# EAGLE design esp8266-pcb (EAGLE 6.4)
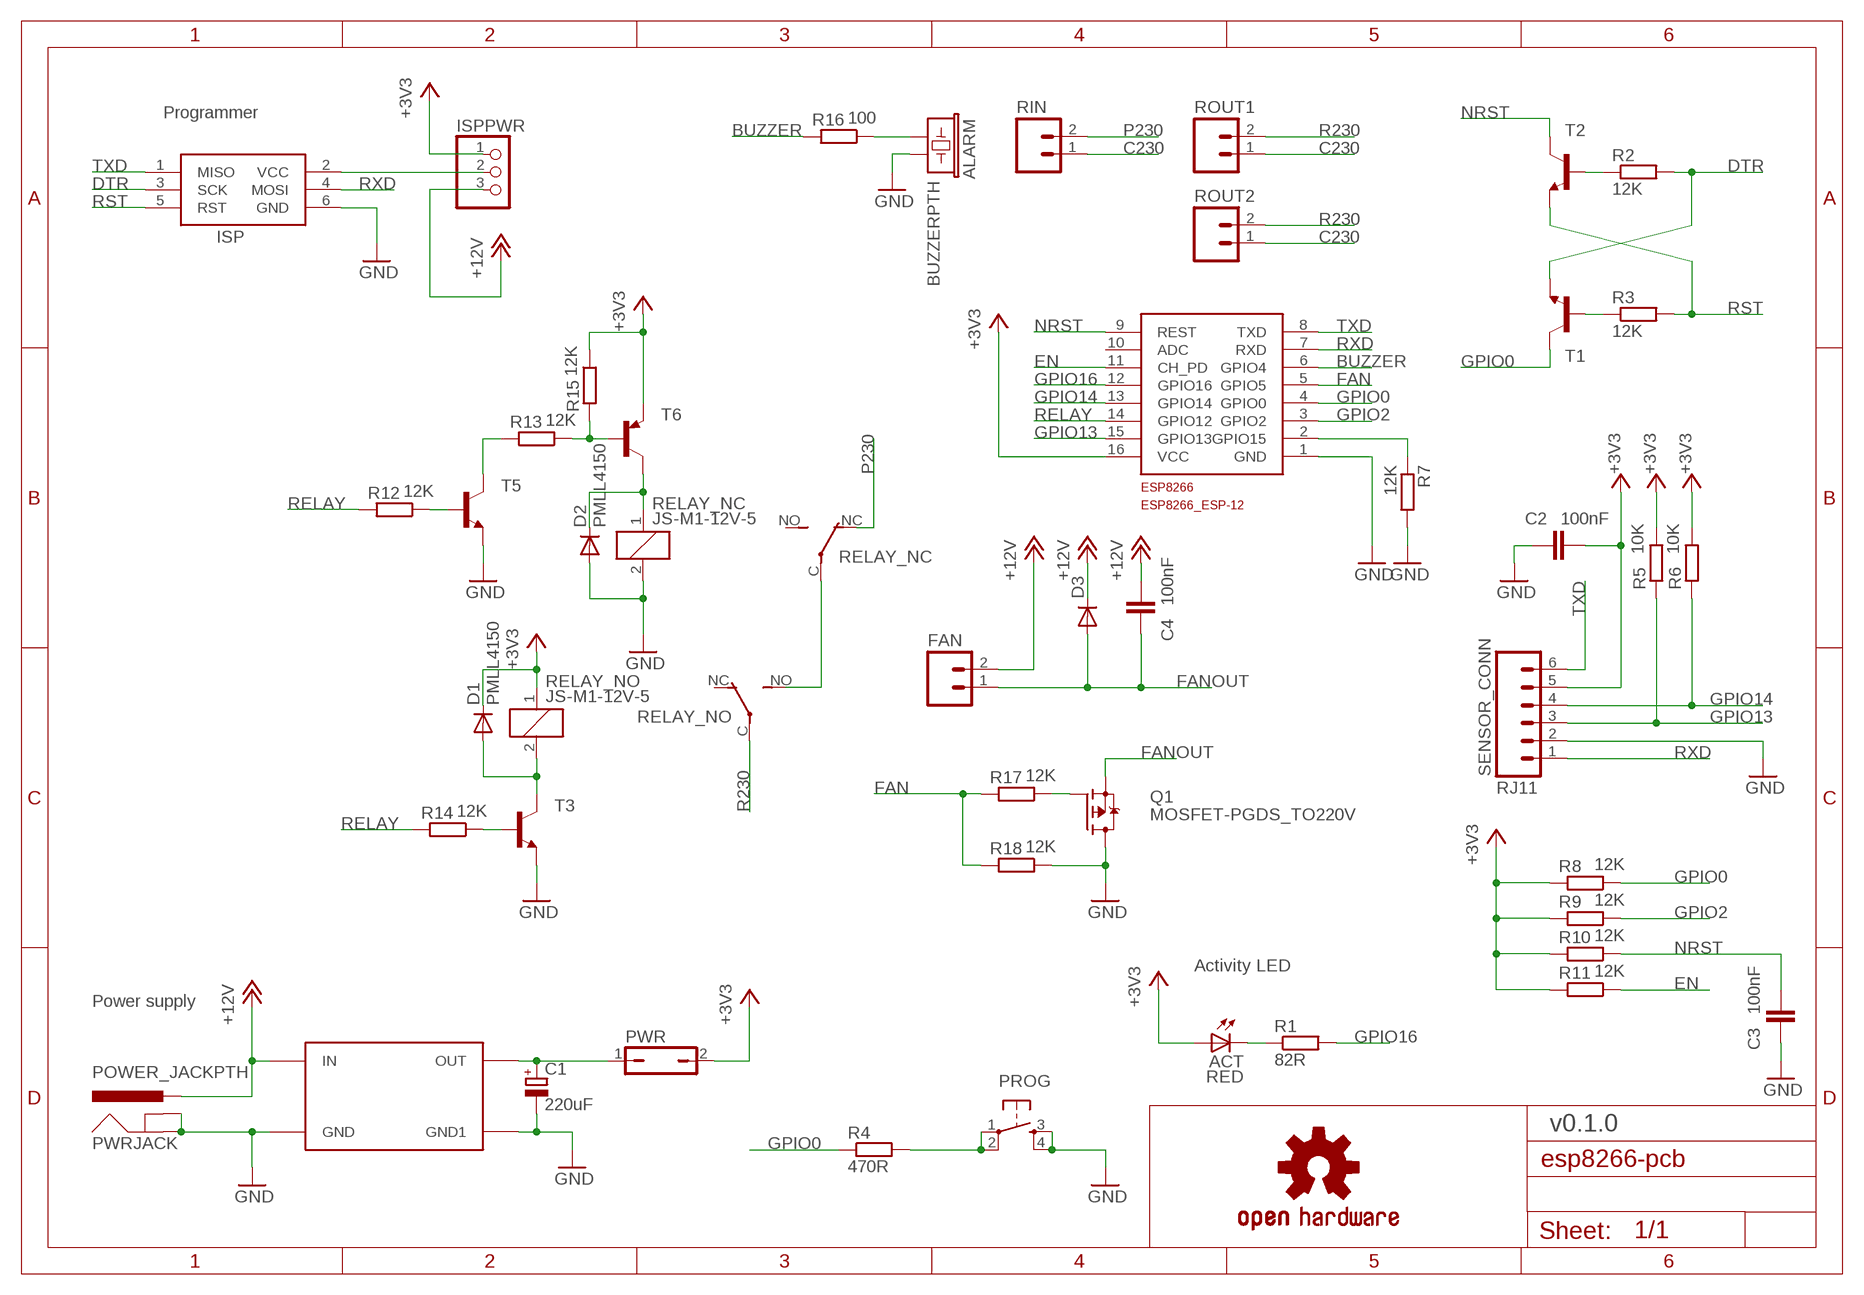
[diagram p0: schematic, sheet 1]

## Parts
ACT  RED  LEDSMT1206  [1206]
ALARM  BUZZERPTH  [BUZZER-12MM]
C1  220uF  CPOL-EUE2.5-6  [E2,5-6]
C2  100nF  C-EUC0805  [C0805]
C3  100nF  C-EUC0805  [C0805]
C4  100nF  C-EUC0805  [C0805]
D1  PMLL4150  [SOD80C]
D2  PMLL4150  [SOD80C]
D3  DIODE-MELF-MLL41  [MELF-MLL41]
ESP8266  ESP8266_ESP-12  [ESP8266-ESP12]
FAN  M025MM  [SCREWTERMINAL-5MM-2]
ISP  AVRISP-6  [AVRISP]
ISPPWR  PINHD-1X3  [1X03]
PROG  TAC_SWITCHPTH  [TACTILE-PTH]
PWR  JP1Q  [JP1]
PWRJACK  POWER_JACKPTH  [POWER_JACK_PTH]
Q1  MOSFET-PGDS_TO220V  [TO220V]
R1  82R  R-EU_R0805  [R0805]
R2  12K  R-EU_R0805  [R0805]
R3  12K  R-EU_R0805  [R0805]
R4  470R  R-EU_R0805  [R0805]
R5  10K  R-EU_R0805  [R0805]
R6  10K  R-EU_R0805  [R0805]
R7  12K  R-EU_R0805  [R0805]
R8  12K  R-EU_R0805  [R0805]
R9  12K  R-EU_R0805  [R0805]
R10  12K  R-EU_R0805  [R0805]
R11  12K  R-EU_R0805  [R0805]
R12  12K  R-EU_R0805  [R0805]
R13  12K  R-EU_R0805  [R0805]
R14  12K  R-EU_R0805  [R0805]
R15  12K  R-EU_R0805  [R0805]
R16  100  R-EU_R0805  [R0805]
R17  12K  R-EU_R0805  [R0805]
R18  12K  R-EU_R0805  [R0805]
RELAY_NC  JS-M1-12V-5  [JS-M]
RELAY_NO  JS-M1-12V-5  [JS-M]
RIN  M025MM  [SCREWTERMINAL-5MM-2]
ROUT1  M025MM  [SCREWTERMINAL-5MM-2]
ROUT2  M025MM  [SCREWTERMINAL-5MM-2]
SENSOR_CONN  RJ11  RJ11-6PTH  [RJ11-6]
T1  BC808-NPN-SOT23-BEC  [SOT23-BEC]
T2  BC808-NPN-SOT23-BEC  [SOT23-BEC]
T3  BC808-NPN-SOT23-BEC  [SOT23-BEC]
T5  BC808-NPN-SOT23-BEC  [SOT23-BEC]
T6  BC807-16-PNP-SOT23-BEC  [SOT23-BEC]
U$1  OSHW-LOGOL  [OSHW-LOGO-L]
U$2  DC-DC-SMALL  [DC-DC]

## Nets
+3V3: ACT.A C2.2 D1.C ESP8266.16(VCC) ISPPWR.1 PWR.2 R5.2 R6.2 R8.2 R9.2 R10.2 R11.2 R15.1 RELAY_NO.1 SENSOR_CONN.5 T6.E
+12V: C4.2 D3.C FAN.2 ISPPWR.3 PWRJACK.PWR U$2.P$1(IN)
BUZZER: ESP8266.6(GPIO4) R16.2
C230: RIN.1 ROUT1.1 ROUT2.1
DTR: ISP.3(SCK) R2.2 T1.E
EN: ESP8266.11(CH_PD) R11.1
FAN: ESP8266.5(GPIO5) R17.2 R18.2
FANOUT: C4.1 D3.A FAN.1 Q1.3(S)
GND: ALARM.- C1.- C2.1 C3.1 D2.A ESP8266.1(GND) ISP.6(GND) PROG.3 PROG.4 PWRJACK.GND PWRJACK.GNDBREAK Q1.2(D) R7.2 R18.1 RELAY_NC.2 SENSOR_CONN.2 T3.E T5.E U$2.P$3(GND) U$2.P$4(GND1)
GPIO0: ESP8266.4(GPIO0) R4.1 R8.1 T1.C
GPIO2: ESP8266.3(GPIO2) R9.1
GPIO13: ESP8266.15(GPIO13) R5.1 SENSOR_CONN.3
GPIO14: ESP8266.13(GPIO14) R6.1 SENSOR_CONN.4
GPIO16: ESP8266.12(GPIO16) R1.2
N$1: ACT.C R1.1
N$2: C1.+ PWR.1 U$2.P$2(OUT)
N$3: R2.1 T2.B
N$4: PROG.1 PROG.2 R4.2
N$5: ESP8266.2(GPIO15) R7.1
N$6: ISP.2(VCC) ISPPWR.2
N$7: R3.1 T1.B
N$8: ALARM.+ R16.1
N$9: D1.A RELAY_NO.2 T3.C
N$11: R14.1 T3.B
N$12: R12.1 T5.B
N$13: R13.2 T5.C
N$14: R13.1 R15.2 T6.B
N$15: D2.C RELAY_NC.1 T6.C
N$17: RELAY_NC.C(2:P) RELAY_NO.NO(2:S)
N$18: Q1.1(G) R17.1
NRST: C3.2 ESP8266.9(REST) R10.1 T2.C
P230: RELAY_NC.NC(2:O) RIN.2
R230: RELAY_NO.C(2:P) ROUT1.2 ROUT2.2
RELAY: ESP8266.14(GPIO12) R12.2 R14.2
RST: ISP.5(RST) R3.2 T2.E
RXD: ESP8266.7(RXD) ISP.4(MOSI) SENSOR_CONN.1
TXD: ESP8266.8(TXD) ISP.1(MISO) SENSOR_CONN.6
Unconnected: ESP8266.10(ADC) RELAY_NC.NO(2:S) RELAY_NO.NC(2:O)

## Notes on the sheet
- Programmer
- Activity LED
- Power supply
- v0.1.0

## Library data of the parts
ACT = led:LED: LED OSRAM: - CHIPLED LG R971, LG N971, LY N971, LG Q971, LY Q971, LO R971, LY R971 LH N974, LH R974 LS Q976, LO Q976, LY Q976 LO Q996 - Hyper CHIPLED LW Q18S LB Q993, LB Q99A, LB R99A - SideLED LS A670, LO A670, LY A670, LG A670, LP A670 LB A673, LV A673, LT A673, LW A673 LH A674 LY A675 LS A676, LA A676, LO A676, LY A676, LW A676 LS A679, LY A679, LG A679 - Hyper Micro SIDELED® LS Y876, LA Y876, LO Y876, LY Y876 LT Y87S - SmartLED LW L88C, LW L88S LB L89C, LB L89S, LG L890 LS L89K, LO L89K, LY L89K LS L896, LA L896, LO L896, LY L896 - TOPLED LS T670, LO T670, LY T670, LG T670, LP T670 LSG T670, LSP T670, LSY T670, LOP T670, LYG T670 LG T671, LOG T671, LSG T671 LB T673, LV T673, LT T673, LW T673 LH T674 LS T676, LA T676, LO T676, LY T676, LB T676, LH T676, LSB T676, LW T676 LB T67C, LV T67C, LT T67C, LS T67K, LO T67K, LY T67K, LW E67C LS E67B, LA E67B, LO E67B, LY E67B, LB E67C, LV E67C, LT E67C LW T67C LS T679, LY T679, LG T679 LS T770, LO T770, LY T770, LG T770, LP T770 LB T773, LV T773, LT T773, LW T773 LH T774 LS E675, LA E675, LY E675, LS T675 LS T776, LA T776, LO T776, LY T776, LB T776 LHGB T686 LT T68C, LB T68C - Hyper Mini TOPLED® LB M676 - Mini TOPLED Santana® LG M470 LS M47K, LO M47K, LY M47K Source: http://www.osram.convergy.de LUXEON: - LUMILED® LXK2-PW12-R00, LXK2-PW12-S00, LXK2-PW14-U00, LXK2-PW14-V00 LXK2-PM12-R00, LXK2-PM12-S00, LXK2-PM14-U00 LXK2-PE12-Q00, LXK2-PE12-R00, LXK2-PE12-S00, LXK2-PE14-T00, LXK2-PE14-U00 LXK2-PB12-K00, LXK2-PB12-L00, LXK2-PB12-M00, LXK2-PB14-N00, LXK2-PB14-P00, LXK2-PB14-Q00 LXK2-PR12-L00, LXK2-PR12-M00, LXK2-PR14-Q00, LXK2-PR14-R00 LXK2-PD12-Q00, LXK2-PD12-R00, LXK2-PD12-S00 LXK2-PH12-R00, LXK2-PH12-S00 LXK2-PL12-P00, LXK2-PL12-Q00, LXK2-PL12-R00 Source: www.luxeon.com KINGBRIGHT: KA-3528ASYC Source: www.kingbright.com
ALARM = SparkFun:BUZZER: Buzzer 12mm Spark Fun Electronics SKU : Comp-Buzzer
C1 = rcl:CPOL-EU: POLARIZED CAPACITOR, European symbol
C2-C4 = rcl:C-EU: CAPACITOR, European symbol
D1 D2 = diode:PMLL4150: DIODE high speed
D3 = diode:DIODE-: DIODE
ESP8266 = ESP8266-ESP12:ESP8266_ESP-12
FAN RIN ROUT1 ROUT2 = SparkFun-Connectors:M02: Standard 2-pin 0.1" header. Use with - straight break away headers ( PRT-00116) - right angle break away headers (PRT-00553) - swiss pins (PRT-00743) - machine pins (PRT-00117) - female headers (PRT-00115) Molex polarized connector foot print use with: PRT-08233 with associated crimp pins and housings. 2.54_SCREWTERM for use with PRT-10571. 3.5mm Screw Terminal footprints for PRT-08084 5mm Screw Terminal footprints for use with PRT-08432; STOREFRONT_ID: PRT-08432
ISP = adafruit:AVRISP: AVR ISP HEADER Standard 6 pin header for AVR programming
ISPPWR = pinhead:PINHD-1X3: PIN HEADER
PROG = SparkFun-Retired:TAC_SWITCH: Momentary Switch Button commonly used for reset or general input. Spark Fun Electronics SKU : COM-00097 SMT- SWCH-08247
PWR = jumper:JP1Q: JUMPER
PWRJACK = SparkFun-Connectors:POWER_JACK: Power Jack This is the standard 5.5mm barrel jack for power. The PTH is the most common, proven, reliable, footprint. The Slot footprint only works if the mill layer is transmitted to the PCB fab house so be warned. Mating wall wart : TOL-00298 (and others); PROD_ID: CONN-08197
Q1 = adafruit:MOSFET-P
R1-R18 = rcl:R-EU_: RESISTOR, European symbol
RELAY_NC RELAY_NO = relay:JS-M1*: Automotive Ultra-Miniature Power Relay NAiS Source: http://www.mew-europe.com/.. en_ds_61211_0000.pdf
SENSOR_CONN = SparkFun-Connectors:RJ11-6: RJ11 Jack Simple 6 pin RJ11 jack. Commonly found on CAT3 devices and Microchip programmers. SKU: PRT-00132; PROD_ID: CONN-08590
T1-T3 T5 = transistor:*-NPN-: NPN Transistror BF959 corrected 2008.03.06
T6 = transistor:*-PNP-: PNP Transistror
U$1 = SparkFun:OSHW-LOGO: Open Source Hardware Logo This logo indicates the piece of hardware it is found on incorporates a OSHW license and/or adheres to the definition of open source hardware found here: http://freedomdefined.org/OSHW
U$2 = OK1CDJ-E6:DC-DC-SMALL

## Board
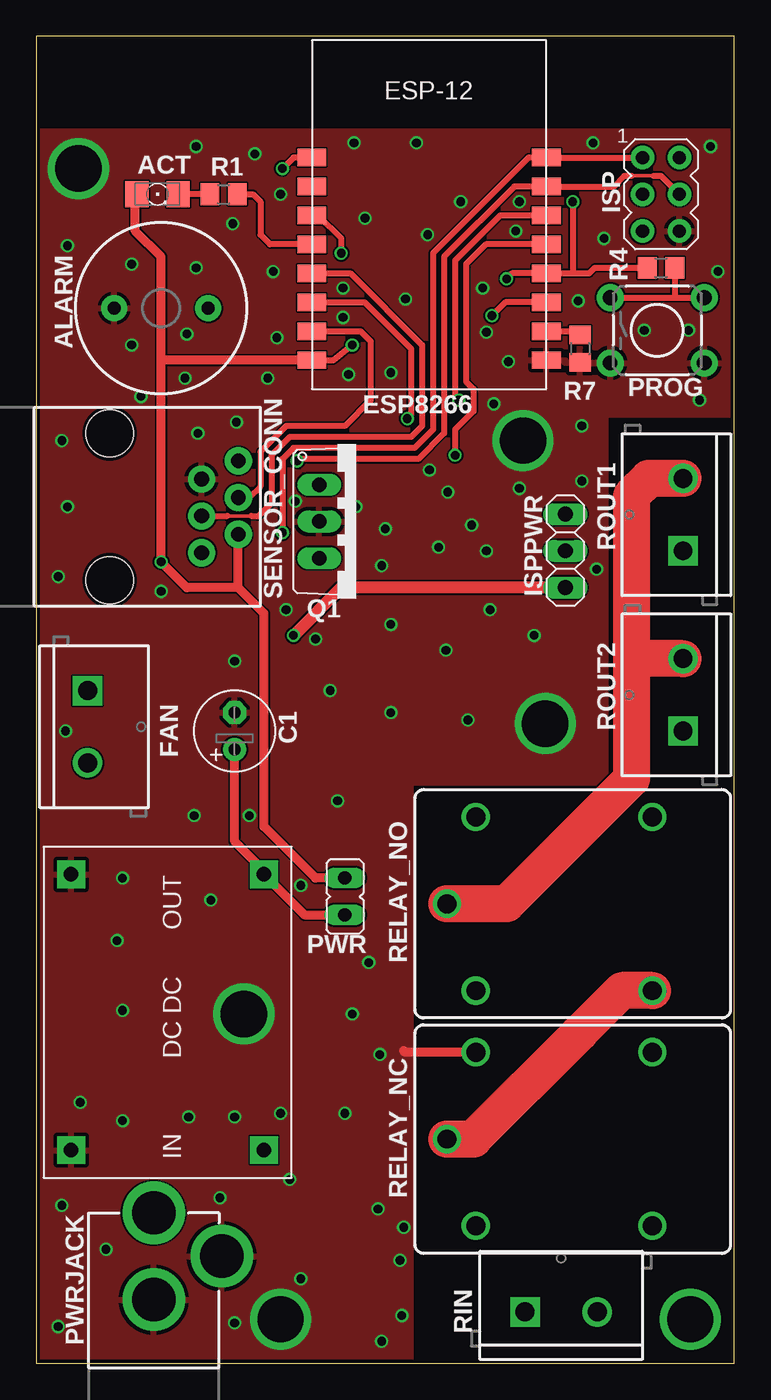
[diagram p1: board, top side]
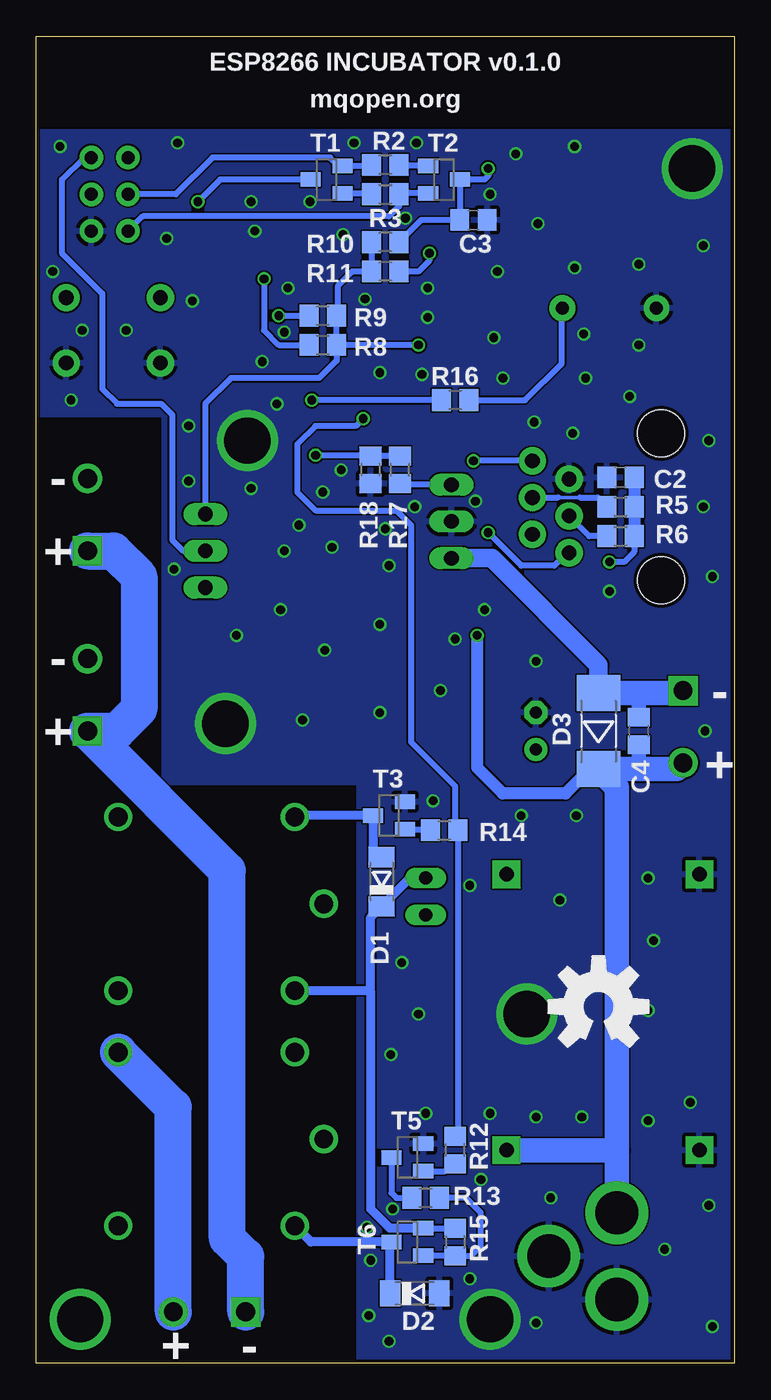
[diagram p2: board, bottom side, seen from below]

Size 48.26 x 91.69 mm. Coordinates in mm from the lower left corner, seen from the top.
Outline: 0,0 48.26,0 48.26,91.69 0,91.69 0,0
Copper layers (1*16): Top 0.035mm / dielectric 1.5mm / Bottom 0.035mm
Design rules "dirt_cheap_dirty_boards.v1": minimum track width 5mil, minimum drill 12mil, track to track 5mil, track to pad 5mil, pad to pad 5mil, via to via 5mil, smd to smd 0mil, copper to edge 10mil, drill to drill 10mil, minimum pad ring 10mil, minimum via ring 6mil, stop-mask expansion 2mil, vias tented up to drill 25mil, thermal gap 10mil

### Footprints (pad centres in the part's own frame; a part is rotated, then mirrored left to right if it is on the bottom)
1206 = smd 1.6 x 1.803: A -1.422,0; C 1.422,0
BUZZER-12MM = drill 0.9 pad 1.778: + 3.25,0; - -3.25,0
E2,5-6 = drill 0.813 pad 1.6: + -1.27,0 | drill 0.813 pad 1.6 octagon: - 1.27,0
C0805 = smd 1.3 x 1.5: 1 -0.95,0; 2 0.95,0
SOD80C = smd 1.4 x 1.8: A 1.7,0; C -1.7,0
MELF-MLL41 = smd 2.5 x 3: A 2.625,0; C -2.625,0
ESP8266-ESP12 = smd 2 x 1.2: 1 16.2,2; 2 16.2,4; 3 16.2,6; 4 16.2,8; 5 16.2,10; 6 16.2,12; 7 16.2,14; 8 16.2,16; 9 0,16; 10 0,14; 11 0,12; 12 0,10; 13 0,8; 14 0,6; 15 0,4; 16 0,2
SCREWTERMINAL-5MM-2 = drill 1.3 pad 2.032 square: 1 0,0 | drill 1.3 pad 2.032: 2 5,0
AVRISP = drill 0.9 pad 1.626: 1 -1.27,2.54; 2 1.27,2.54; 3 -1.27,0; 4 1.27,0; 5 -1.27,-2.54; 6 1.27,-2.54
1X03 = drill 1.016 long: 1 -2.54,0; 2 0,0; 3 2.54,0
TACTILE-PTH = drill 1.016 pad 1.88: 1 -3.251,2.261; 2 3.251,2.261; 3 -3.251,-2.261; 4 3.251,-2.261
JP1 = drill 0.914 long: 1 0,-1.27; 2 0,1.27
POWER_JACK_PTH = drill 2.997 pad 4.318: GND 0,7.7; GNDBREAK 4.7,10.7; PWR 0,13.7
TO220V = drill 1.016 long: 1 -2.54,-2.54; 2 0,-2.54; 3 2.54,-2.54
R0805 = smd 1.3 x 1.5: 1 -0.95,0; 2 0.95,0
JS-M = drill 1.3: 1 6.7,6; 2 6.7,-6; C 8.7,0; NC -5.5,-6; NO -5.5,6
RJ11-6 = drill 1.016 pad 1.88: 1 -3.175,8.89; 2 -1.905,6.35; 3 -0.635,8.89; 4 0.635,6.35; 5 1.905,8.89; 6 3.175,6.35 | hole 3.251: -5.08,0; 5.08,0
SOT23-BEC = smd 1 x 1.4: B -0.95,-1.1; C 0,1.1; E 0.95,-1.1
DC-DC = drill 1 pad 1.93 square: P$1 1.27,1.27; P$2 20.32,1.27; P$3 1.27,14.605; P$4 20.32,14.605

### Placement (x,y rotation side)
ACT  8.38,80.77 0 top
ALARM  8.64,72.9 0 top
C1  13.72,43.69 90 top
C2  7.87,61.21 0 bottom
C3  18.03,78.99 180 bottom
C4  6.6,43.69 270 bottom
D1  24.38,33.27 90 bottom
D2  22.1,4.83 0 bottom
D3  9.4,43.69 90 bottom
ESP8266  19.05,67.31 0 top
FAN  3.56,46.48 270 top
ISP  43.18,80.77 0 top
ISPPWR  36.58,56.13 270 top
PROG  42.93,71.37 0 top
PWR  21.34,32.26 0 top
PWRJACK  8.13,-3.3 0 top
Q1  22.1,58.17 270 top
R1  12.95,80.77 0 top
R2  24.13,82.8 180 bottom
R3  24.13,80.77 0 bottom
R4  43.18,75.69 0 top
R5  7.87,59.18 0 bottom
R6  7.87,57.15 0 bottom
R7  37.59,70.1 270 top
R8  28.45,70.36 0 bottom
R9  28.45,72.39 0 bottom
R10  24.13,77.47 180 bottom
R11  24.13,75.44 180 bottom
R12  19.3,14.73 90 bottom
R13  21.34,11.43 180 bottom
R14  20.07,36.83 0 bottom
R15  19.3,8.38 270 bottom
R16  19.3,66.55 180 bottom
R17  23.11,61.72 90 bottom
R18  25.15,61.72 90 bottom
RELAY_NC  37.08,15.49 180 top
RELAY_NO  37.08,31.75 180 top
RIN  33.78,3.56 0 top
ROUT1  44.7,56.13 90 top
ROUT2  44.7,43.69 90 top
SENSOR_CONN  5.08,59.18 270 top
T1  28.19,81.79 90 bottom
T2  20.07,81.79 270 bottom
T3  23.88,37.85 90 bottom
T5  22.61,14.22 90 bottom
T6  22.61,8.38 90 bottom
U$1  9.4,24.64 0 bottom
U$2  17.02,13.46 90 top

### Tracks (layer width: path | path; a pad name or v marks a point on that pad's centre or on a via)
+3V3  (via drill 0.6)
  Top 0.406: ESP8266.16 20.54,69.31 v21.84,70.36
  Top 0.61: PWR.2 19.3,33.53 15.75,37.08 15.75,51.82 13.97,53.59 | 13.97,53.59 10.41,53.59 v8.64,55.37 8.64,69.34 | 13.97,53.59 SENSOR_CONN.5 | 8.64,69.34 8.64,76.45 6.86,78.23 6.86,80.67 ACT.A | ESP8266.16 8.67,69.31 8.64,69.34
  Bottom 0.406: T6.E R15.1 | R6.2 6.92,56.07 7.62,55.37 v8.64,55.37 | v21.84,70.36 R8.2 | R8.2 R9.2 27.43,72.46 27.43,74.42 26.42,75.44 R11.2 R10.2 | R8.2 27.5,69.28 28.7,68.07 34.8,68.07 36.58,66.29 ISPPWR.1
  Bottom 0.61: T6.E 23.81,9.33 25.15,10.67 25.15,25.65 | 25.15,25.65 25.15,30.81 D1.C 22.43,33.53 PWR.2 | RELAY_NO.1 25.24,25.75 25.15,25.65
  Bottom 0.813: C2.2 R5.2 R6.2
+12V  (via drill 0.6)
  Top 0.813: ISPPWR.3 21.08,53.59 v17.78,50.29
  Bottom 0.813: D3.C 9.99,41.06 11.68,39.37 16,39.37 17.78,41.15 v17.78,50.29
  Bottom 1.016: C4.2 6.6,41.06
  Bottom 1.676: PWRJACK.PWR 8.13,14.73 | 8.13,14.73 8.13,39.79 D3.C 6.6,41.06 3.98,41.06 FAN.2 | U$2.P$1 8.13,14.73
BUZZER  (via drill 0.6)
  Top 0.406: v29.21,66.55 28.96,66.8 28.96,76.2 32.07,79.31 ESP8266.6
  Bottom 0.406: R16.2 v29.21,66.55
C230
  Bottom 2.54: RIN.1 33.78,7.37 35.05,8.64 35.05,34.04 ROUT2.1 42.67,43.69 41.15,45.21 41.15,54.36 42.93,56.13 ROUT1.1
DTR
  Bottom 0.406: R2.2 25.15,82.74 T1.E 27.37,82.74 27.94,83.31 36.07,83.31 38.61,80.77 ISP.3
EN  (via drill 0.6)
  Top 0.406: ESP8266.11 19.5,79.31 21.08,77.72 v21.08,76.71
  Bottom 0.406: v21.08,76.71 21.08,76.2 21.84,75.44 R11.1
FAN  (via drill 0.6)
  Top 0.406: v28.96,62.74 28.96,64.52 30.23,65.79 30.23,67.31 29.72,67.82 29.72,75.95 31.08,77.31 ESP8266.5
  Bottom 0.406: R17.2 R18.2 25.21,62.74 v28.96,62.74
FANOUT
  Bottom 1.016: C4.1 6.6,46.31
  Bottom 1.27: Q1.3 16.76,55.63 9.4,48.26 D3.A
  Bottom 1.676: D3.A 6.6,46.31 3.73,46.31 FAN.1
GND  (via drill 0.6, 3.2)
  Top 0.61: RELAY_NC.2 25.5,21.49 25.4,21.59
  other vias: 21.84,24.13 20.83,38.86 13.72,17.02 5.59,29.21 3.05,18.03 12.7,11.43 23.62,10.67 25.15,7.11 25.4,9.4 18.29,5.84 17.53,12.7 21.34,17.27 13.72,2.79 4.83,7.87 1.78,10.92 1.52,2.54 23.88,1.52 18.29,33.02 19.3,50.04 10.92,37.85 2.03,43.69 1.52,54.36 1.78,63.75 11.18,64.26 8.64,53.34 17.27,52.07 27.18,61.72 28.45,60.2 24.13,57.66 23.88,55.12 21.59,68.33 16,68.07 10.41,71.12 6.6,70.36 6.6,75.95 21.21,74.3 21.21,72.26 24.51,68.45 25.53,73.53 32.64,69.22 31.11,71.25 30.86,74.3 33.15,78.23 33.4,80.26 29.34,80.26 27.05,77.98 21.97,84.33 26.29,84.33 16.89,80.77 15.11,83.57 2.92,82.55 2.16,77.22 11.05,84.07 11.05,75.69 13.59,78.74 39.24,77.72 46.61,84.07 38.48,84.33 47.12,75.44 45.09,71.37 42.04,71.37 37.47,73.41 37.72,64.77 45.85,66.55 31.62,66.29 30.1,57.91 31.11,56.13 33.4,60.45 37.72,60.96 38.73,54.86 34.42,50.29 31.37,52.07 24.51,51.05 24.51,44.96 28.32,49.28 22.99,27.69 12.06,32 16.89,17.27 10.54,17.02 5.97,24.38 5.97,16.76 5.97,33.53 23.75,21.34 25.27,3.3 27.81,56.39 13.84,65.02 10.29,68.07 7.24,66.8 2.16,59.18 16.38,75.44 16.64,70.87 22.73,79.12 16.89,3.05 33.66,63.75 14.35,24.13 22.1,59.18 17.91,59.56 29.84,44.45 14.73,37.85 13.72,48.51 20.32,46.48 35.18,44.2
  pour Bottom: -0.25,85.09 -0.25,-0.25 25.91,-0.25 25.91,40.13 39.37,40.13 39.37,65.53 48.51,65.53 48.51,85.09
  pour Top: -0.25,85.09 -0.25,-0.25 25.91,-0.25 25.91,40.13 39.37,40.13 39.37,65.53 48.51,65.53 48.51,85.09
GPIO0  (via drill 0.6)
  Top 0.406: 37.08,75.31 ESP8266.4 32.89,75.31 v32.51,74.93 | 37.08,75.31 38.23,75.31 38.61,75.69 R4.1 | v37.08,80.26 37.08,75.31
  Bottom 0.406: T1.C 35.56,81.79 v37.08,80.26 | v32.51,74.93 32.51,71.37 31.5,70.36 R8.1
GPIO2  (via drill 0.6)
  Top 0.406: ESP8266.3 32.42,73.31 v31.5,72.39
  Bottom 0.406: v31.5,72.39 R9.1
GPIO13
  Top 0.406: SENSOR_CONN.3 14.73,59.82 15.49,60.58 15.49,62.99 17.27,64.77 21.34,64.77 23.11,66.55 23.11,70.61 22.42,71.31 ESP8266.15
  Bottom 0.254: 12.19,59.82 10.67,59.82
  Bottom 0.406: SENSOR_CONN.3 12.19,59.82 | 10.67,59.82 9.46,59.82 R5.1
GPIO14
  Top 0.254: 13.21,58.55 14.86,58.55
  Top 0.406: SENSOR_CONN.4 13.21,58.55 | 14.86,58.55 15.37,58.55 16.26,59.44 16.26,62.74 17.53,64.01 25.91,64.01 26.67,64.77 26.67,70.36 21.72,75.31 ESP8266.13
  Bottom 0.406: R6.1 10.03,57.15 SENSOR_CONN.4
GPIO16
  Top 0.406: R1.2 14.99,80.77 15.49,80.26 15.49,77.98 16.16,77.31 ESP8266.12
N$1
  Top 0.406: R1.1 ACT.C
N$2
  Top 0.61: C1.+ 13.72,36.07 15.75,34.04 U$2.P$2 18.54,30.99 PWR.1
N$3
  Bottom 0.406: T2.B 23.11,82.74 R2.1
N$4
  Top 0.406: PROG.1 44.2,73.64 | 44.2,73.64 PROG.2 | R4.2 44.13,73.7 44.2,73.64
N$5
  Top 0.406: ESP8266.2 37.34,71.31 R7.1
N$6
  Bottom 0.406: ISP.2 44.96,83.31 46.48,81.79 46.48,76.71 43.69,73.91 43.69,67.31 42.67,66.29 39.62,66.29 38.86,65.53 38.86,56.9 38.1,56.13 ISPPWR.2
N$7
  Bottom 0.406: T1.B 25.15,80.84 R3.1
N$8
  Bottom 0.406: R16.1 14.48,66.55 11.94,69.09 11.94,72.85 ALARM.+
N$9
  Bottom 0.61: D1.A 24.98,35.57 T3.C 30.29,37.85 RELAY_NO.2
N$10  (via drill 3.2)
  other vias: 45.21,3.05
N$11
  Bottom 0.406: T3.B 21.08,36.9 R14.1
N$12
  Bottom 0.406: T5.B 20,13.27 19.81,13.46 19.62,13.46 R12.1
N$13
  Bottom 0.406: T5.C 23.71,11.77 23.37,11.43 R13.2
N$14
  Bottom 0.406: R13.1 18.54,11.43 17.53,10.41 17.53,8.13 18.22,7.43 R15.2 T6.B
N$15
  Bottom 0.61: RELAY_NC.1 29.27,8.38 T6.C 23.8,8.29 D2.C
N$17
  Top 2.54: RELAY_NC.C 30.23,15.49 37.47,22.73 37.59,22.86 40.48,25.75 RELAY_NO.NO
N$18
  Bottom 0.406: Q1.1 22.54,60.71 R17.1
NRST  (via drill 0.6)
  Top 0.406: ESP8266.9 17.78,83.31 v17.02,82.55
  Bottom 0.406: v17.02,82.55 17.02,82.04 17.27,81.79 T2.C 18.97,79.01 C3.2 21.66,78.99 R10.1
P230
  Bottom 2.54: RIN.2 38.78,17.69 RELAY_NC.NC
R230
  Top 2.54: ROUT1.2 42.34,61.13 41.15,59.94 41.15,48.51 | 41.15,48.51 41.15,40.39 32.51,31.75 RELAY_NO.C | ROUT2.2 41.32,48.69 41.15,48.51
RELAY  (via drill 0.6)
  Top 0.406: v25.65,65.28 25.91,65.53 25.91,70.1 22.7,73.31 ESP8266.14
  Bottom 0.406: R12.2 19.12,15.87 R14.2 19.3,37.02 19.3,39.88 22.35,42.93 22.35,57.91 23.37,58.93 28.96,58.93 30.23,60.2 30.23,63.5 28.96,64.77 26.16,64.77 v25.65,65.28
RST
  Bottom 0.406: T2.E 23.11,80.84 R3.2 23.18,79.94 23.88,79.25 40.89,79.25 ISP.5
RXD  (via drill 0.6)
  Top 0.254: 41.15,82.04 42.67,82.04
  Top 0.406: 41.15,82.04 40.64,82.04 39.91,81.31 ESP8266.7 33.05,81.31 28.19,76.45 28.19,64.26 26.42,62.48 18.16,62.48 v18.03,62.36 | 42.67,82.04 43.18,82.04 ISP.4
  Bottom 0.406: SENSOR_CONN.1 v18.03,62.36
TXD  (via drill 0.6)
  Top 0.406: ESP8266.8 ISP.1 | v17.02,57.4 17.02,62.48 17.78,63.25 26.16,63.25 27.43,64.52 27.43,76.71 34.03,83.31 ESP8266.8 | ESP8266.8
  Bottom 0.406: SENSOR_CONN.6 11.56,56.01 12.45,55.12 14.73,55.12 v17.02,57.4

### Text on the board
bNames: ESP8266 INCUBATOR v0.1.0 | mqopen.org | - | + | - | - | + | + | - | +